# Altium schematic sheet main.SchDoc
size A4
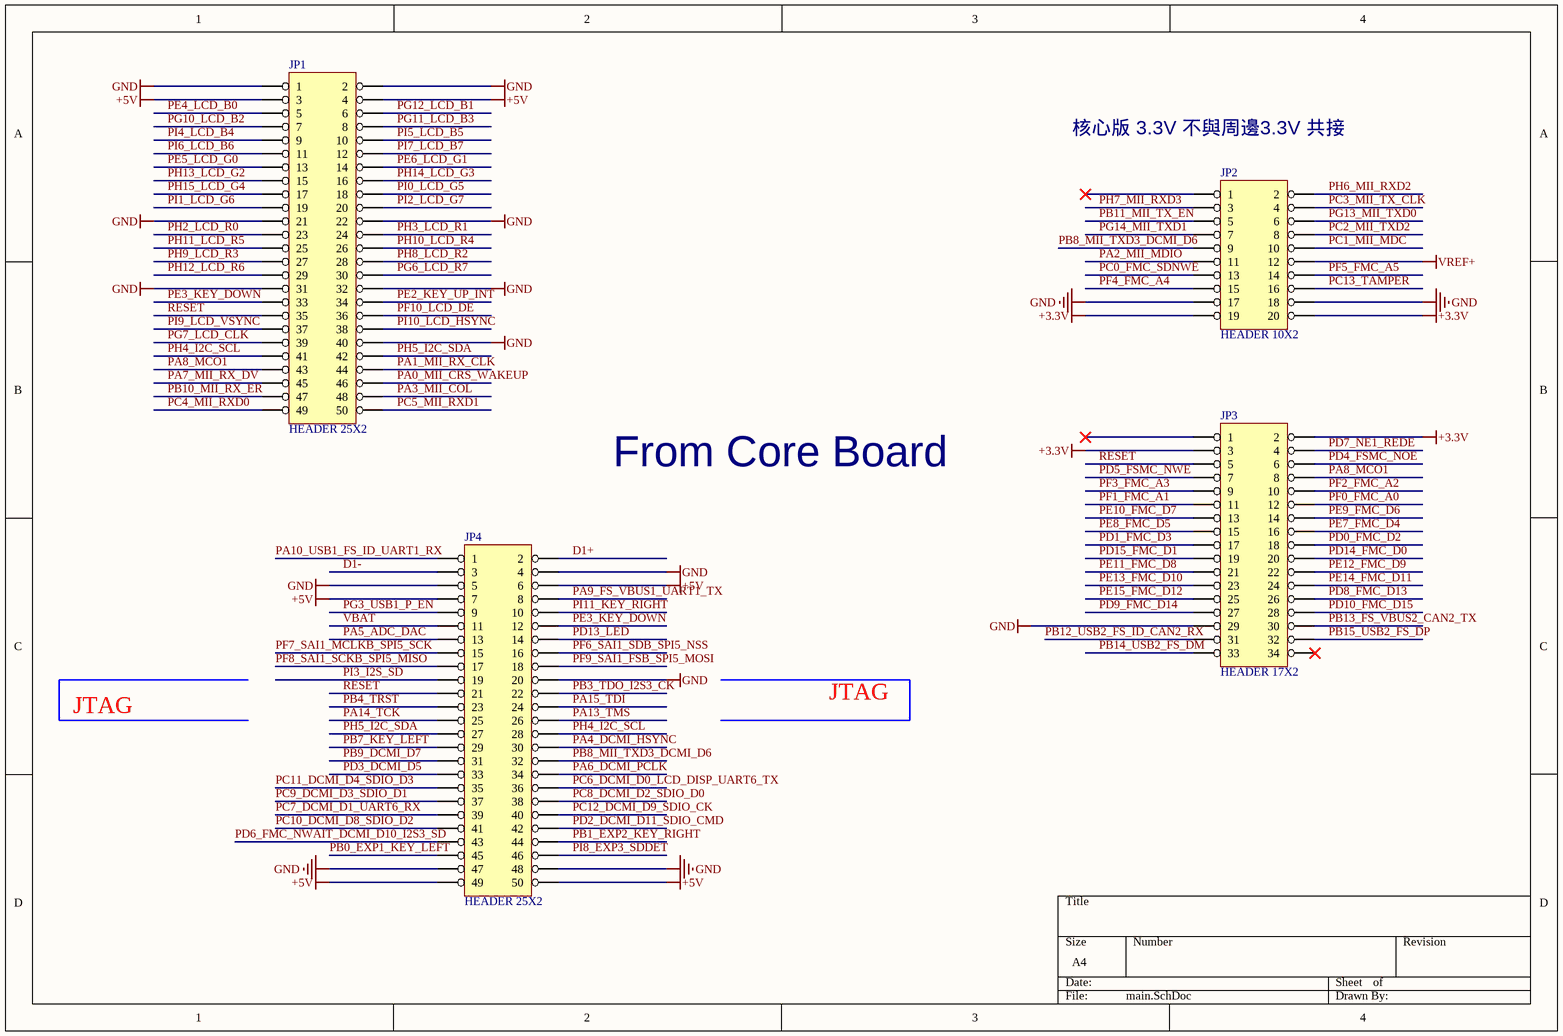
[diagram p0: main.SchDoc]

## Parts
JP1  HEADER 25X2  [SIP-50-1.27-SMD]
JP2  HEADER 10X2  [SIP-20-1.27-SMD]
JP3  HEADER 17X2  [SIP-34-1.27-SMD]
JP4  HEADER 25X2  [SIP-50-1.27-SMD]

## Nets
+3.3V: JP2.19 JP2.20 JP3.2 JP3.3
+5V: JP1.3 JP1.4 JP4.6 JP4.7 JP4.49 JP4.50
GND: JP1.1 JP1.2 JP1.21 JP1.22 JP1.31 JP1.32 JP1.40 JP2.17 JP2.18 JP3.29 JP4.4 JP4.5 JP4.20 JP4.47 JP4.48
VREF+: JP2.12
D1+: JP4.2
D1-: JP4.3
PA0_MII_CRS_WAKEUP: JP1.46
PA1_MII_RX_CLK: JP1.44
PA2_MII_MDIO: JP2.11
PA3_MII_COL: JP1.48
PA4_DCMI_HSYNC: JP4.30
PA5_ADC_DAC: JP4.13
PA6_DCMI_PCLK: JP4.34
PA7_MII_RX_DV: JP1.45
PA8_MCO1: JP1.43 JP3.8
PA9_FS_VBUS1_UART1_TX: JP4.8
PA10_USB1_FS_ID_UART1_RX: JP4.1
PA13_TMS: JP4.26
PA14_TCK: JP4.25
PA15_TDI: JP4.24
PB0_EXP1_KEY_LEFT: JP4.45
PB1_EXP2_KEY_RIGHT: JP4.44
PB3_TDO_I2S3_CK: JP4.22
PB4_TRST: JP4.23
PB7_KEY_LEFT: JP4.29
PB8_MII_TXD3_DCMI_D6: JP2.9 JP4.32
PB9_DCMI_D7: JP4.31
PB10_MII_RX_ER: JP1.47
PB11_MII_TX_EN: JP2.5
PB12_USB2_FS_ID_CAN2_RX: JP3.31
PB13_FS_VBUS2_CAN2_TX: JP3.30
PB14_USB2_FS_DM: JP3.33
PB15_USB2_FS_DP: JP3.32
PC0_FMC_SDNWE: JP2.13
PC1_MII_MDC: JP2.10
PC2_MII_TXD2: JP2.8
PC3_MII_TX_CLK: JP2.4
PC4_MII_RXD0: JP1.49
PC5_MII_RXD1: JP1.50
PC6_DCMI_D0_LCD_DISP_UART6_TX: JP4.36
PC7_DCMI_D1_UART6_RX: JP4.39
PC8_DCMI_D2_SDIO_D0: JP4.38
PC9_DCMI_D3_SDIO_D1: JP4.37
PC10_DCMI_D8_SDIO_D2: JP4.41
PC11_DCMI_D4_SDIO_D3: JP4.35
PC12_DCMI_D9_SDIO_CK: JP4.40
PC13_TAMPER: JP2.16
PD0_FMC_D2: JP3.18
PD1_FMC_D3: JP3.17
PD2_DCMI_D11_SDIO_CMD: JP4.42
PD3_DCMI_D5: JP4.33
PD4_FSMC_NOE: JP3.6
PD5_FSMC_NWE: JP3.7
PD6_FMC_NWAIT_DCMI_D10_I2S3_SD: JP4.43
PD7_NE1_REDE: JP3.4
PD8_FMC_D13: JP3.26
PD9_FMC_D14: JP3.27
PD10_FMC_D15: JP3.28
PD13_LED: JP4.14
PD14_FMC_D0: JP3.20
PD15_FMC_D1: JP3.19
PE2_KEY_UP_INT: JP1.34
PE3_KEY_DOWN: JP1.33 JP4.12
PE4_LCD_B0: JP1.5
PE5_LCD_G0: JP1.13
PE6_LCD_G1: JP1.14
PE7_FMC_D4: JP3.16
PE8_FMC_D5: JP3.15
PE9_FMC_D6: JP3.14
PE10_FMC_D7: JP3.13
PE11_FMC_D8: JP3.21
PE12_FMC_D9: JP3.22
PE13_FMC_D10: JP3.23
PE14_FMC_D11: JP3.24
PE15_FMC_D12: JP3.25
PF0_FMC_A0: JP3.12
PF1_FMC_A1: JP3.11
PF2_FMC_A2: JP3.10
PF3_FMC_A3: JP3.9
PF4_FMC_A4: JP2.15
PF5_FMC_A5: JP2.14
PF6_SAI1_SDB_SPI5_NSS: JP4.16
PF7_SAI1_MCLKB_SPI5_SCK: JP4.15
PF8_SAI1_SCKB_SPI5_MISO: JP4.17
PF9_SAI1_FSB_SPI5_MOSI: JP4.18
PF10_LCD_DE: JP1.36
PG3_USB1_P_EN: JP4.9
PG6_LCD_R7: JP1.30
PG7_LCD_CLK: JP1.39
PG10_LCD_B2: JP1.7
PG11_LCD_B3: JP1.8
PG12_LCD_B1: JP1.6
PG13_MII_TXD0: JP2.6
PG14_MII_TXD1: JP2.7
PH2_LCD_R0: JP1.23
PH3_LCD_R1: JP1.24
PH4_I2C_SCL: JP1.41 JP4.28
PH5_I2C_SDA: JP1.42 JP4.27
PH6_MII_RXD2: JP2.2
PH7_MII_RXD3: JP2.3
PH8_LCD_R2: JP1.28
PH9_LCD_R3: JP1.27
PH10_LCD_R4: JP1.26
PH11_LCD_R5: JP1.25
PH12_LCD_R6: JP1.29
PH13_LCD_G2: JP1.15
PH14_LCD_G3: JP1.16
PH15_LCD_G4: JP1.17
PI0_LCD_G5: JP1.18
PI1_LCD_G6: JP1.19
PI2_LCD_G7: JP1.20
PI3_I2S_SD: JP4.19
PI4_LCD_B4: JP1.9
PI5_LCD_B5: JP1.10
PI6_LCD_B6: JP1.11
PI7_LCD_B7: JP1.12
PI8_EXP3_SDDET: JP4.46
PI9_LCD_VSYNC: JP1.37
PI10_LCD_HSYNC: JP1.38
PI11_KEY_RIGHT: JP4.10
RESET: JP1.35 JP3.5 JP4.21
VBAT: JP4.11

Not connected (* = marked no-connect by the designer): JP2 1*; JP3 1* 34*

## Notes on the sheet
- 核心版 3.3V 不與周邊3.3V 共接
- From Core Board
- JTAG